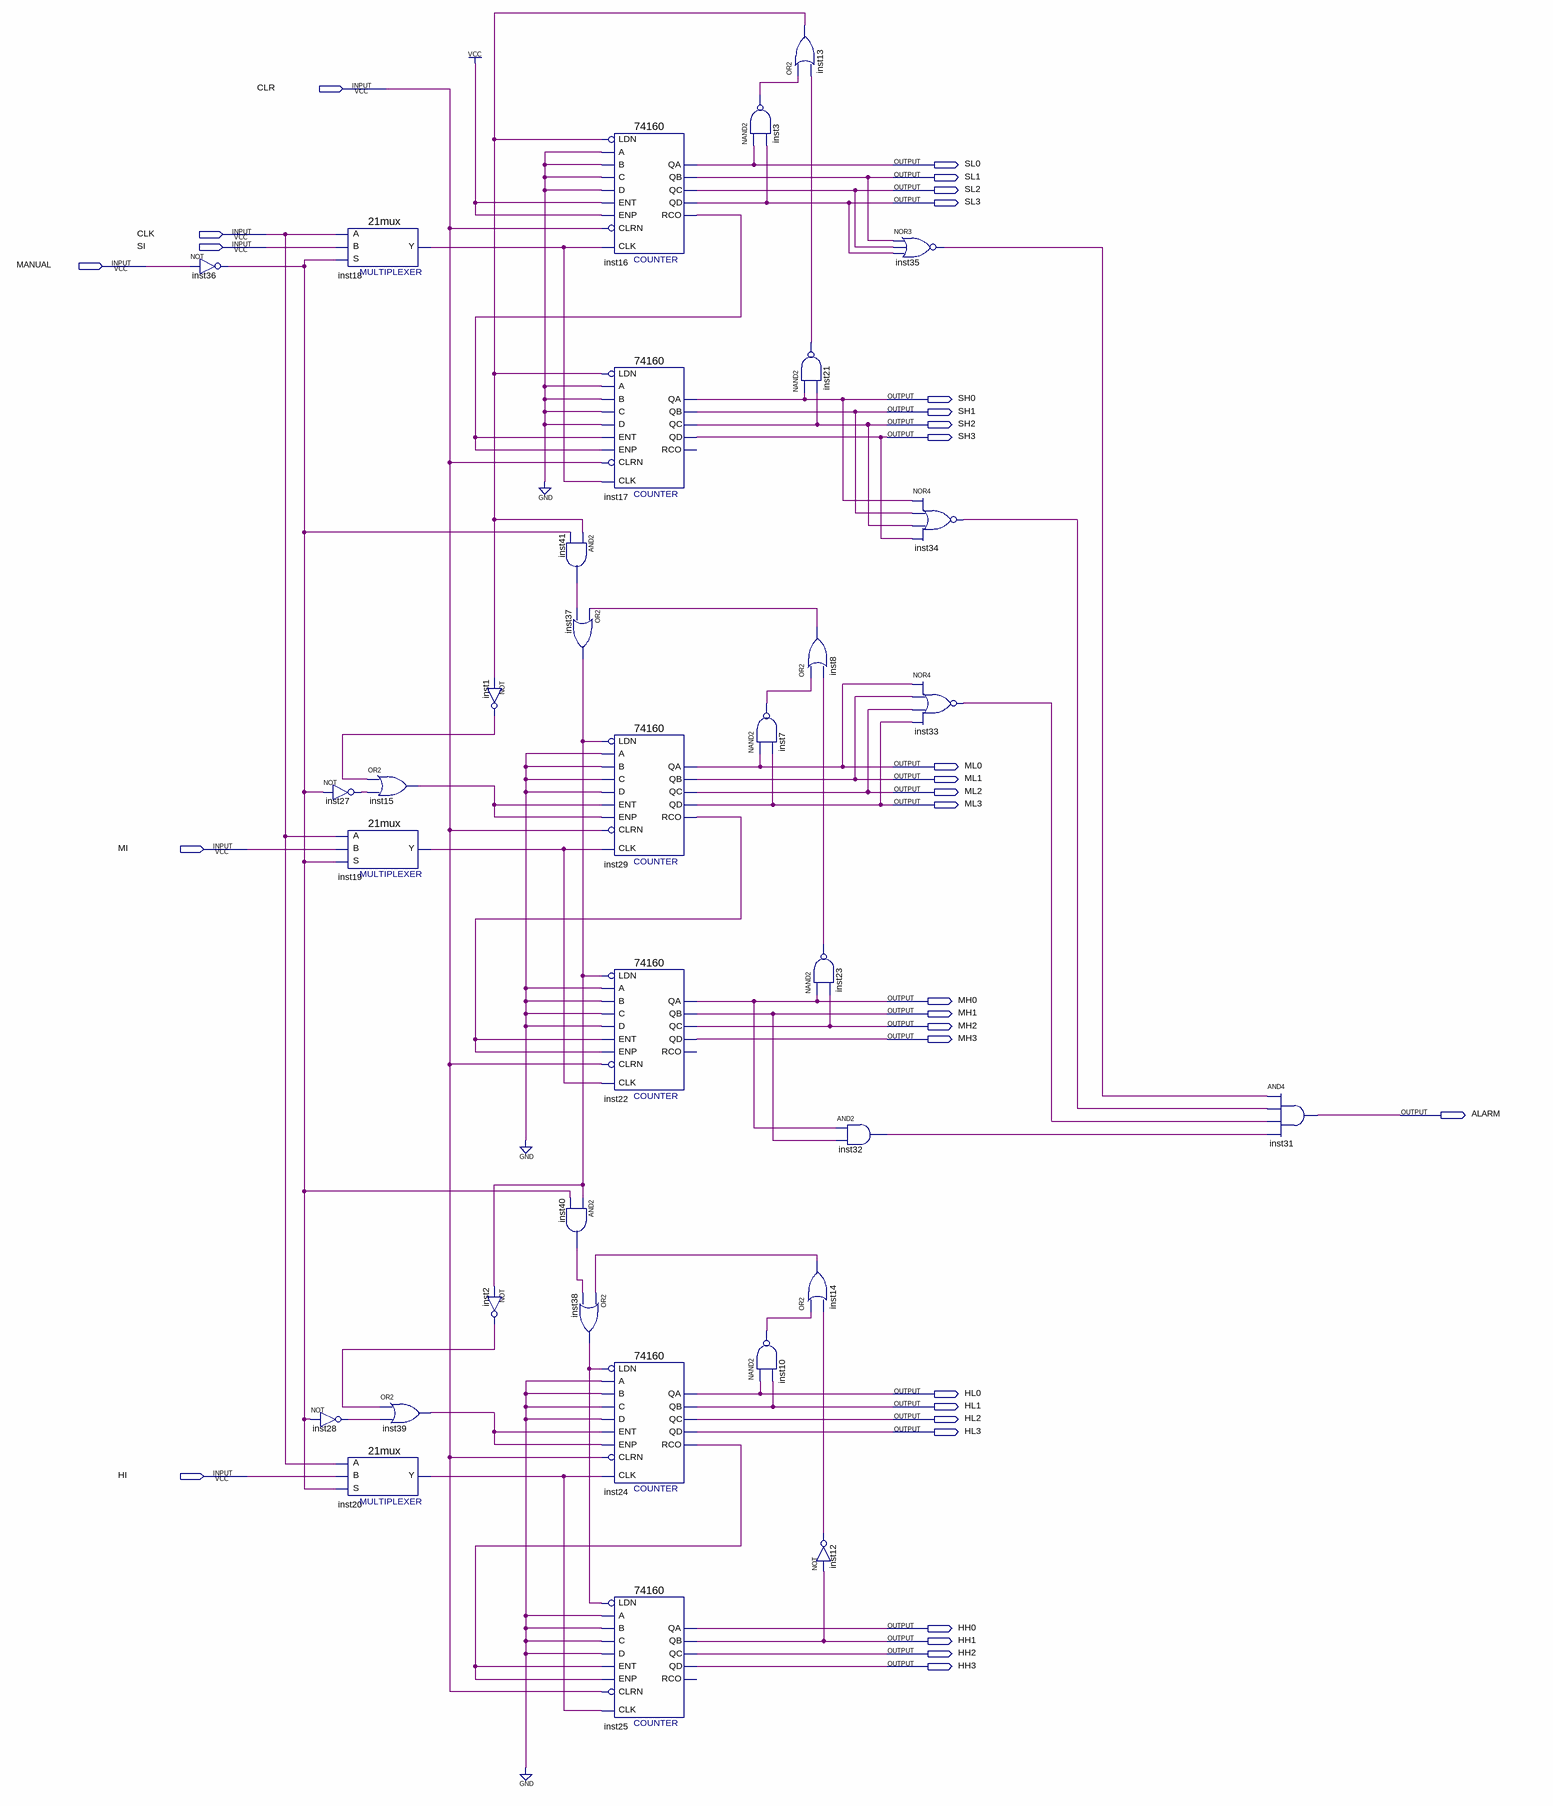
[diagram p0: schematic sheet]
// Quartus schematic clockcount.bdf as structural Verilog: 34 symbols, 31 pins
module clockcount (
  input  CLR,
  input  CLK,
  input  SI,
  input  MANUAL,
  input  MI,
  input  HI,
  output SL0,
  output SL1,
  output SL2,
  output SL3,
  output SH0,
  output SH1,
  output SH2,
  output SH3,
  output ML0,
  output ML1,
  output ML2,
  output ML3,
  output MH0,
  output MH1,
  output MH2,
  output MH3,
  output ALARM,
  output HL0,
  output HL1,
  output HL2,
  output HL3,
  output HH0,
  output HH1,
  output HH2,
  output HH3
);

  wire inst1_out, inst2_out, inst3_out, inst7_out, inst8_out, inst10_out, inst12_out, inst13_out, inst14_out,
       inst15_out, inst16_rco, inst18_y, inst19_y, inst20_y, inst21_out, inst23_out, inst24_rco, inst27_out,
       inst28_out, inst29_rco, inst32_out, inst33_out, inst34_out, inst35_out, inst36_out, inst37_out,
       inst38_out, inst39_out, inst40_out, inst41_out;

  not inst36 (inst36_out, MANUAL);
  \21mux  inst18 (.S(inst36_out), .B(SI), .A(CLK), .Y(inst18_y));
  not inst27 (inst27_out, inst36_out);
  \21mux  inst19 (.S(inst36_out), .B(MI), .A(CLK), .Y(inst19_y));
  not inst28 (inst28_out, inst36_out);
  \21mux  inst20 (.S(inst36_out), .B(HI), .A(CLK), .Y(inst20_y));
  or inst15 (inst15_out, inst1_out, inst27_out);
  or inst39 (inst39_out, inst2_out, inst28_out);
  not inst1 (inst1_out, inst13_out);
  not inst2 (inst2_out, inst37_out);
  \74160  inst16 (
    .CLK(inst18_y), .ENT(1'b1), .A(1'b0), .B(1'b0), .C(1'b0), .D(1'b0), .LDN(inst13_out), .ENP(1'b1),
    .CLRN(CLR), .QD(SL3), .QA(SL0), .QB(SL1), .QC(SL2), .RCO(inst16_rco));
  \74160  inst17 (
    .CLK(inst18_y), .ENT(inst16_rco), .A(1'b0), .B(1'b0), .C(1'b0), .D(1'b0), .LDN(inst13_out),
    .ENP(inst16_rco), .CLRN(CLR), .QD(SH3), .QA(SH0), .QB(SH1), .QC(SH2));  // open: RCO
  and inst41 (inst41_out, inst13_out, inst36_out);
  or inst37 (inst37_out, inst8_out, inst41_out);
  \74160  inst29 (
    .CLK(inst19_y), .ENT(inst15_out), .A(1'b0), .B(1'b0), .C(1'b0), .D(1'b0), .LDN(inst37_out),
    .ENP(inst15_out), .CLRN(CLR), .QD(ML3), .QA(ML0), .QB(ML1), .QC(ML2), .RCO(inst29_rco));
  \74160  inst22 (
    .CLK(inst19_y), .ENT(inst29_rco), .A(1'b0), .B(1'b0), .C(1'b0), .D(1'b0), .LDN(inst37_out),
    .ENP(inst29_rco), .CLRN(CLR), .QD(MH3), .QA(MH0), .QB(MH1), .QC(MH2));  // open: RCO
  and inst40 (inst40_out, inst37_out, inst36_out);
  or inst38 (inst38_out, inst14_out, inst40_out);
  \74160  inst24 (
    .CLK(inst20_y), .ENT(inst39_out), .A(1'b0), .B(1'b0), .C(1'b0), .D(1'b0), .LDN(inst38_out),
    .ENP(inst39_out), .CLRN(CLR), .QD(HL3), .QA(HL0), .QB(HL1), .QC(HL2), .RCO(inst24_rco));
  \74160  inst25 (
    .CLK(inst20_y), .ENT(inst24_rco), .A(1'b0), .B(1'b0), .C(1'b0), .D(1'b0), .LDN(inst38_out),
    .ENP(inst24_rco), .CLRN(CLR), .QD(HH3), .QA(HH0), .QB(HH1), .QC(HH2));  // open: RCO
  nand inst3 (inst3_out, SL0, SL3);
  nand inst7 (inst7_out, ML0, ML3);
  nand inst10 (inst10_out, HL0, HL1);
  or inst13 (inst13_out, inst3_out, inst21_out);
  nand inst21 (inst21_out, SH0, SH2);
  or inst8 (inst8_out, inst7_out, inst23_out);
  nand inst23 (inst23_out, MH0, MH2);
  or inst14 (inst14_out, inst10_out, inst12_out);
  and inst32 (inst32_out, MH0, MH1);
  not inst12 (inst12_out, HH1);
  nor inst35 (inst35_out, SL1, SL2, SL3);
  nor inst34 (inst34_out, SH0, SH1, SH2, SH3);
  nor inst33 (inst33_out, ML0, ML1, ML2, ML3);
  and inst31 (ALARM, inst35_out, inst34_out, inst33_out, inst32_out);
endmodule
